# Altium schematic sheet Sheet4.SchDoc
size A4
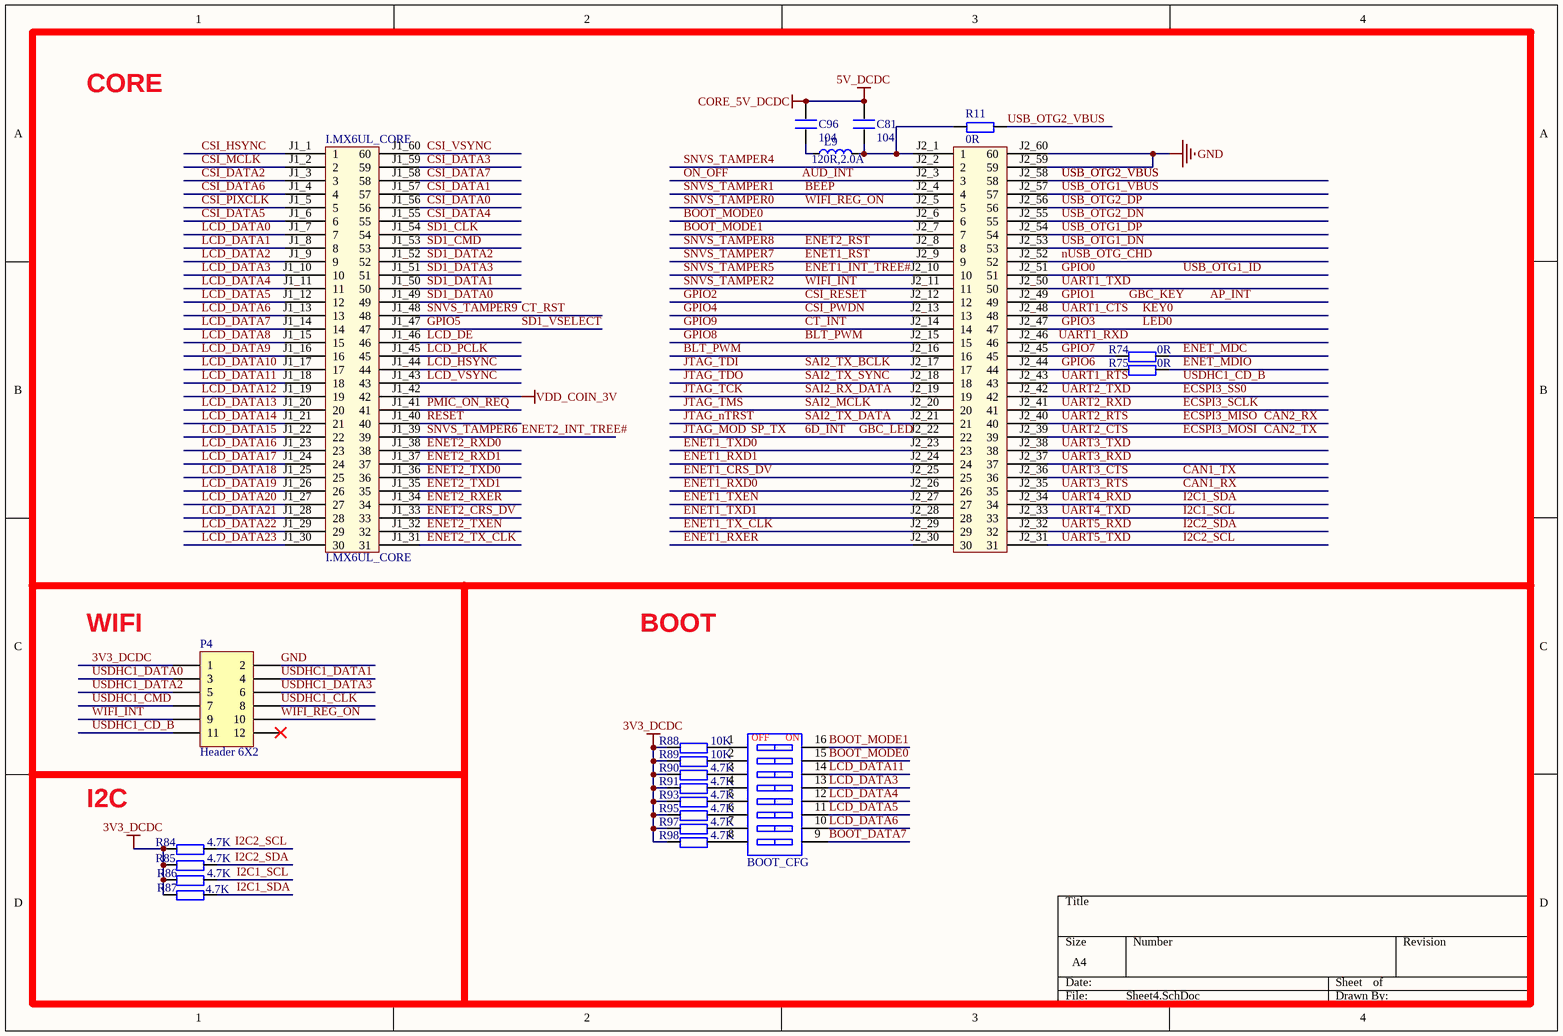
[diagram p0: Sheet4.SchDoc]

## Parts
BOOT_CFG  CSW-8P  [CSW DIP-8P]  (value not drawn)
C81  104  [C 0603]
C96  104  [C 0603]
I.MX6UL_CORE  I.MX6UL_CORE  [I.MX6UL_CORE]
L9  120R,2.0A  [L 0603]
P4  Header 6X2  [HDR2X6]
R11  0R  [R 0603]
R74  0R  [R 0603]
R75  0R  [R 0603]
R84  4.7K  [R 0603]
R85  4.7K  [R 0603]
R86  4.7K  [R 0603]
R87  4.7K  [R 0603]
R88  10K  [R 0603]
R89  10K  [R 0603]
R90  4.7K  [R 0603]
R91  4.7K  [R 0603]
R93  4.7K  [R 0603]
R95  4.7K  [R 0603]
R97  4.7K  [R 0603]
R98  4.7K  [R 0603]

## Nets
3V3_DCDC: P4.1 R84.1 R85.1 R86.1 R87.1 R88.1 R89.1 R90.1 R91.1 R93.1 R95.1 R97.1 R98.1
5V_DCDC: C81.2 C96.2  [also labelled CORE_5V_DCDC]
GND: I.MX6UL_CORE.J2_59(59) I.MX6UL_CORE.J2_60(60) P4.2
VDD_COIN_3V: I.MX6UL_CORE.J1_42(42)
6D_INT: I.MX6UL_CORE.J2_22(22)  [also labelled GBC_LED, JTAG_MOD, SP_TX]
AP_INT: I.MX6UL_CORE.J2_49(49)  [also labelled GBC_KEY, GPIO1]
AUD_INT: I.MX6UL_CORE.J2_3(3)  [also labelled ON_OFF]
BEEP: I.MX6UL_CORE.J2_4(4)  [also labelled SNVS_TAMPER1]
BLT_PWM: I.MX6UL_CORE.J2_15(15) I.MX6UL_CORE.J2_16(16)  [also labelled GPIO8]
BOOT_DATA7: BOOT_CFG.9
BOOT_MODE0: BOOT_CFG.15 I.MX6UL_CORE.J2_6(6)
BOOT_MODE1: BOOT_CFG.16 I.MX6UL_CORE.J2_7(7)
CAN1_RX: I.MX6UL_CORE.J2_35(35)  [also labelled UART3_RTS]
CAN1_TX: I.MX6UL_CORE.J2_36(36)  [also labelled UART3_CTS]
CAN2_RX: I.MX6UL_CORE.J2_40(40)  [also labelled ECSPI3_MISO, UART2_RTS]
CAN2_TX: I.MX6UL_CORE.J2_39(39)  [also labelled ECSPI3_MOSI, UART2_CTS]
CSI_DATA0: I.MX6UL_CORE.J1_56(56)
CSI_DATA1: I.MX6UL_CORE.J1_57(57)
CSI_DATA2: I.MX6UL_CORE.J1_3(3)
CSI_DATA3: I.MX6UL_CORE.J1_59(59)
CSI_DATA4: I.MX6UL_CORE.J1_55(55)
CSI_DATA5: I.MX6UL_CORE.J1_6(6)
CSI_DATA6: I.MX6UL_CORE.J1_4(4)
CSI_DATA7: I.MX6UL_CORE.J1_58(58)
CSI_HSYNC: I.MX6UL_CORE.J1_1(1)
CSI_MCLK: I.MX6UL_CORE.J1_2(2)
CSI_PIXCLK: I.MX6UL_CORE.J1_5(5)
CSI_PWDN: I.MX6UL_CORE.J2_13(13)  [also labelled GPIO4]
CSI_RESET: I.MX6UL_CORE.J2_12(12)  [also labelled GPIO2]
CSI_VSYNC: I.MX6UL_CORE.J1_60(60)
CT_INT: I.MX6UL_CORE.J2_14(14)  [also labelled GPIO9]
CT_RST: I.MX6UL_CORE.J1_48(48)  [also labelled SNVS_TAMPER9]
ECSPI3_SCLK: I.MX6UL_CORE.J2_41(41)  [also labelled UART2_RXD]
ECSPI3_SS0: I.MX6UL_CORE.J2_42(42)  [also labelled UART2_TXD]
ENET1_CRS_DV: I.MX6UL_CORE.J2_25(25)
ENET1_INT_TREE#: I.MX6UL_CORE.J2_10(10)  [also labelled SNVS_TAMPER5]
ENET1_RST: I.MX6UL_CORE.J2_9(9)  [also labelled SNVS_TAMPER7]
ENET1_RXD0: I.MX6UL_CORE.J2_26(26)
ENET1_RXD1: I.MX6UL_CORE.J2_24(24)
ENET1_RXER: I.MX6UL_CORE.J2_30(30)
ENET1_TX_CLK: I.MX6UL_CORE.J2_29(29)
ENET1_TXD0: I.MX6UL_CORE.J2_23(23)
ENET1_TXD1: I.MX6UL_CORE.J2_28(28)
ENET1_TXEN: I.MX6UL_CORE.J2_27(27)
ENET2_CRS_DV: I.MX6UL_CORE.J1_33(33)
ENET2_INT_TREE#: I.MX6UL_CORE.J1_39(39)  [also labelled SNVS_TAMPER6]
ENET2_RST: I.MX6UL_CORE.J2_8(8)  [also labelled SNVS_TAMPER8]
ENET2_RXD0: I.MX6UL_CORE.J1_38(38)
ENET2_RXD1: I.MX6UL_CORE.J1_37(37)
ENET2_RXER: I.MX6UL_CORE.J1_34(34)
ENET2_TX_CLK: I.MX6UL_CORE.J1_31(31)
ENET2_TXD0: I.MX6UL_CORE.J1_36(36)
ENET2_TXD1: I.MX6UL_CORE.J1_35(35)
ENET2_TXEN: I.MX6UL_CORE.J1_32(32)
ENET_MDC: R74.2
ENET_MDIO: R75.2
GPIO0: I.MX6UL_CORE.J2_51(51)  [also labelled USB_OTG1_ID]
GPIO3: I.MX6UL_CORE.J2_47(47)  [also labelled LED0]
GPIO5: I.MX6UL_CORE.J1_47(47)  [also labelled SD1_VSELECT]
GPIO6: I.MX6UL_CORE.J2_44(44) R75.1
GPIO7: I.MX6UL_CORE.J2_45(45) R74.1
I2C1_SCL: I.MX6UL_CORE.J2_33(33) R86.2  [also labelled UART4_TXD]
I2C1_SDA: I.MX6UL_CORE.J2_34(34) R87.2  [also labelled UART4_RXD]
I2C2_SCL: I.MX6UL_CORE.J2_31(31) R84.2  [also labelled UART5_TXD]
I2C2_SDA: I.MX6UL_CORE.J2_32(32) R85.2  [also labelled UART5_RXD]
JTAG_nTRST: I.MX6UL_CORE.J2_21(21)  [also labelled SAI2_TX_DATA]
JTAG_TCK: I.MX6UL_CORE.J2_19(19)  [also labelled SAI2_RX_DATA]
JTAG_TDI: I.MX6UL_CORE.J2_17(17)  [also labelled SAI2_TX_BCLK]
JTAG_TDO: I.MX6UL_CORE.J2_18(18)  [also labelled SAI2_TX_SYNC]
JTAG_TMS: I.MX6UL_CORE.J2_20(20)  [also labelled SAI2_MCLK]
KEY0: I.MX6UL_CORE.J2_48(48)  [also labelled UART1_CTS]
LCD_DATA0: I.MX6UL_CORE.J1_7(7)
LCD_DATA1: I.MX6UL_CORE.J1_8(8)
LCD_DATA2: I.MX6UL_CORE.J1_9(9)
LCD_DATA3: BOOT_CFG.13 I.MX6UL_CORE.J1_10(10)
LCD_DATA4: BOOT_CFG.12 I.MX6UL_CORE.J1_11(11)
LCD_DATA5: BOOT_CFG.11 I.MX6UL_CORE.J1_12(12)
LCD_DATA6: BOOT_CFG.10 I.MX6UL_CORE.J1_13(13)
LCD_DATA7: I.MX6UL_CORE.J1_14(14)
LCD_DATA8: I.MX6UL_CORE.J1_15(15)
LCD_DATA9: I.MX6UL_CORE.J1_16(16)
LCD_DATA10: I.MX6UL_CORE.J1_17(17)
LCD_DATA11: BOOT_CFG.14 I.MX6UL_CORE.J1_18(18)
LCD_DATA12: I.MX6UL_CORE.J1_19(19)
LCD_DATA13: I.MX6UL_CORE.J1_20(20)
LCD_DATA14: I.MX6UL_CORE.J1_21(21)
LCD_DATA15: I.MX6UL_CORE.J1_22(22)
LCD_DATA16: I.MX6UL_CORE.J1_23(23)
LCD_DATA17: I.MX6UL_CORE.J1_24(24)
LCD_DATA18: I.MX6UL_CORE.J1_25(25)
LCD_DATA19: I.MX6UL_CORE.J1_26(26)
LCD_DATA20: I.MX6UL_CORE.J1_27(27)
LCD_DATA21: I.MX6UL_CORE.J1_28(28)
LCD_DATA22: I.MX6UL_CORE.J1_29(29)
LCD_DATA23: I.MX6UL_CORE.J1_30(30)
LCD_DE: I.MX6UL_CORE.J1_46(46)
LCD_HSYNC: I.MX6UL_CORE.J1_44(44)
LCD_PCLK: I.MX6UL_CORE.J1_45(45)
LCD_VSYNC: I.MX6UL_CORE.J1_43(43)
nUSB_OTG_CHD: I.MX6UL_CORE.J2_52(52)
PMIC_ON_REQ: I.MX6UL_CORE.J1_41(41)
RESET: I.MX6UL_CORE.J1_40(40)
SD1_CLK: I.MX6UL_CORE.J1_54(54)
SD1_CMD: I.MX6UL_CORE.J1_53(53)
SD1_DATA0: I.MX6UL_CORE.J1_49(49)
SD1_DATA1: I.MX6UL_CORE.J1_50(50)
SD1_DATA2: I.MX6UL_CORE.J1_52(52)
SD1_DATA3: I.MX6UL_CORE.J1_51(51)
SNVS_TAMPER0: I.MX6UL_CORE.J2_5(5) P4.10  [also labelled WIFI_REG_ON]
SNVS_TAMPER2: I.MX6UL_CORE.J2_11(11) P4.9  [also labelled WIFI_INT]
SNVS_TAMPER4: I.MX6UL_CORE.J2_2(2)
UART1_RTS: I.MX6UL_CORE.J2_43(43) P4.11  [also labelled USDHC1_CD_B]
UART1_RXD: I.MX6UL_CORE.J2_46(46)
UART1_TXD: I.MX6UL_CORE.J2_50(50)
UART3_RXD: I.MX6UL_CORE.J2_37(37)
UART3_TXD: I.MX6UL_CORE.J2_38(38)
USB_OTG1_DN: I.MX6UL_CORE.J2_53(53)
USB_OTG1_DP: I.MX6UL_CORE.J2_54(54)
USB_OTG1_VBUS: I.MX6UL_CORE.J2_57(57)
USB_OTG2_DN: I.MX6UL_CORE.J2_55(55)
USB_OTG2_DP: I.MX6UL_CORE.J2_56(56)
USB_OTG2_VBUS: I.MX6UL_CORE.J2_58(58) R11.2
USDHC1_CLK: P4.8
USDHC1_CMD: P4.7
USDHC1_DATA0: P4.3
USDHC1_DATA1: P4.4
USDHC1_DATA2: P4.5
USDHC1_DATA3: P4.6
NetBOOT_CFG_1: BOOT_CFG.1 R88.2
NetBOOT_CFG_2: BOOT_CFG.2 R89.2
NetBOOT_CFG_3: BOOT_CFG.3 R90.2
NetBOOT_CFG_4: BOOT_CFG.4 R91.2
NetBOOT_CFG_5: BOOT_CFG.5 R93.2
NetBOOT_CFG_6: BOOT_CFG.6 R95.2
NetBOOT_CFG_7: BOOT_CFG.7 R97.2
NetBOOT_CFG_8: BOOT_CFG.8 R98.2
NetC81_1: C81.1 I.MX6UL_CORE.J2_1(1) L9.2 R11.1
NetC96_1: C96.1 L9.1

Not connected (* = marked no-connect by the designer): P4 12*

## Notes on the sheet
- CORE
- WIFI
- BOOT
- I2C
- (in symbol CSW-8P) OFF; ON

## Library data of the parts
BOOT_CFG = CSW-8P: 8路编码开关; 版权归属: 源创客; BOM名称: 8路编码开关; 学习资源: www.ooocke.com
C81 C96 = C
I.MX6UL_CORE = I.MX6UL核心板
L9 = L: 小功率贴片电感磁珠; 版权归属: 源创客; BOM名称: 小功率贴片电感; 学习资源: www.ooocke.com
P4 = Header 6X2: Header, 6-Pin, Dual row; LatestRevisionDate: 17-Jul-2002; LatestRevisionNote: Re-released for DXP Platform.; Publisher: Altium Limited
R11 R74 R75 R84-R91 R93 R95 R97 R98 = R